# Altium schematic sheet Fault_Module.SchDoc
size Letter; Organization: Altium Limited; Address1: L3, 12a Rodborough Rd; Address2: Frenchs Forest; Address3: NSW; Address4: Australia 2086; DocumentNumber: D_4; SheetNumber: 4; SheetTotal: 21
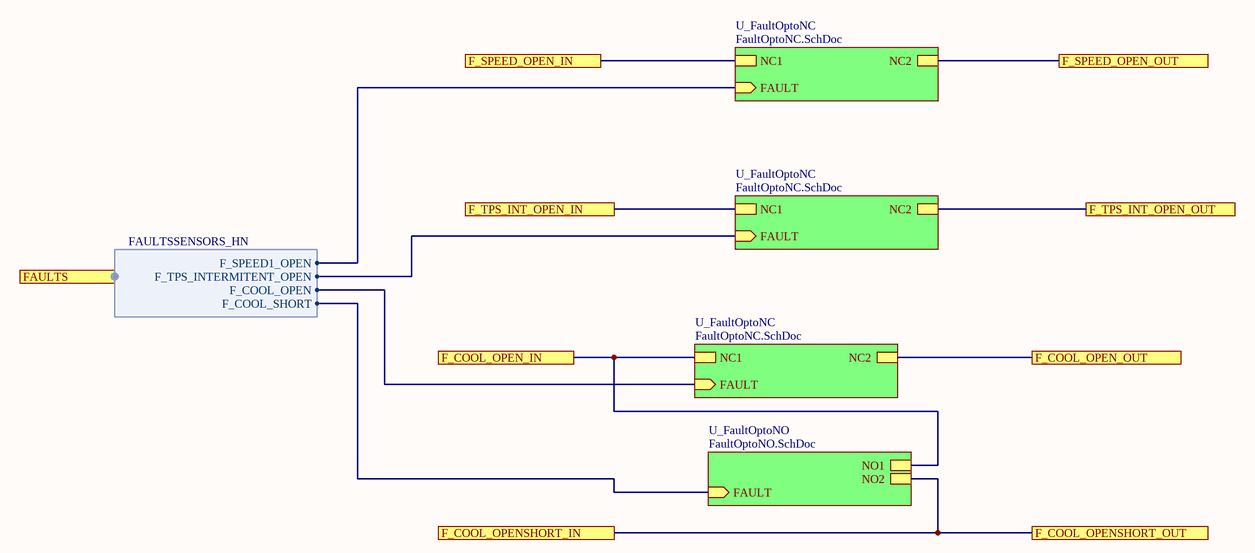
[diagram p0: Fault_Module.SchDoc]

## Sub-sheets
U_FaultOptoNC = FaultOptoNC.SchDoc: NC1, NC2, FAULT (in)
U_FaultOptoNC = FaultOptoNC.SchDoc: NC1, NC2, FAULT (in)
U_FaultOptoNC = FaultOptoNC.SchDoc: NC1, NC2, FAULT (in)
U_FaultOptoNO = FaultOptoNO.SchDoc: NO1, NO2, FAULT (in)

## Ports
F_COOL_OPEN_IN, F_COOL_OPEN_OUT, F_COOL_OPENSHORT_IN, F_COOL_OPENSHORT_OUT, F_SPEED_OPEN_IN, F_SPEED_OPEN_OUT, F_TPS_INT_OPEN_IN, F_TPS_INT_OPEN_OUT, FAULTS (harness FAULTSSENSORS_HN)

## Harnesses
FAULTSSENSORS_HN: F_SPEED1_OPEN, F_TPS_INTERMITENT_OPEN, F_COOL_OPEN, F_COOL_SHORT

## Nets
F_COOL_OPEN_IN: port F_COOL_OPEN_IN, sheet U_FaultOptoNC/NC1, sheet U_FaultOptoNO/NO1
F_COOL_OPEN_OUT: port F_COOL_OPEN_OUT, sheet U_FaultOptoNC/NC2
F_COOL_OPENSHORT_IN: port F_COOL_OPENSHORT_OUT, port F_COOL_OPENSHORT_IN, sheet U_FaultOptoNO/NO2
F_SPEED_OPEN_IN: port F_SPEED_OPEN_IN, sheet U_FaultOptoNC/NC1
F_SPEED_OPEN_OUT: port F_SPEED_OPEN_OUT, sheet U_FaultOptoNC/NC2
F_TPS_INT_OPEN_IN: port F_TPS_INT_OPEN_IN, sheet U_FaultOptoNC/NC1
F_TPS_INT_OPEN_OUT: port F_TPS_INT_OPEN_OUT, sheet U_FaultOptoNC/NC2
(unnamed): sheet U_FaultOptoNC/FAULT, port FAULTS.F_SPEED1_OPEN
(unnamed): sheet U_FaultOptoNC/FAULT, port FAULTS.F_TPS_INTERMITENT_OPEN
(unnamed): sheet U_FaultOptoNC/FAULT, port FAULTS.F_COOL_OPEN
(unnamed): sheet U_FaultOptoNO/FAULT, port FAULTS.F_COOL_SHORT

## Notes on the sheet
- Title
- Size:
- Date:
- Letter
- Number:
- Time:
- Revision:
- Sheet
- of
- Fluid Power Training
- Institute Inc.
- 2170 S 3040 W
- Salt Lake City, 84119,UT.
- United States.
- File: